# EAGLE schematic Master (EAGLE 7.1.0)
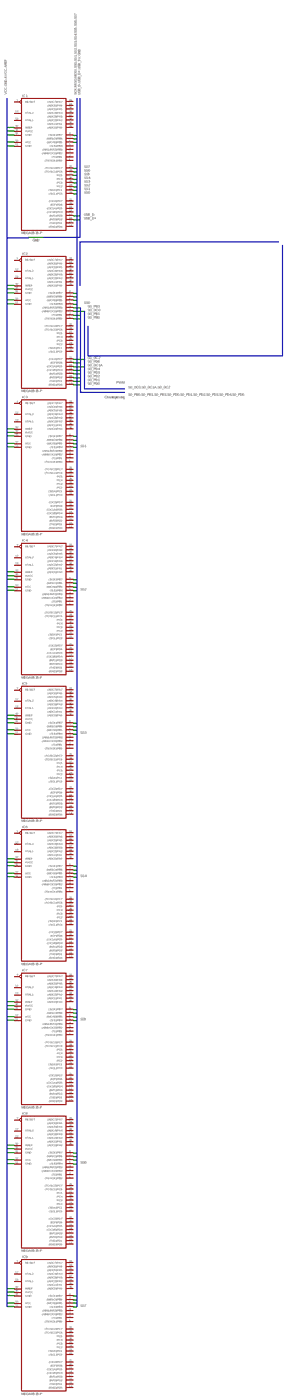
[diagram p0: schematic, sheet 1, overview]
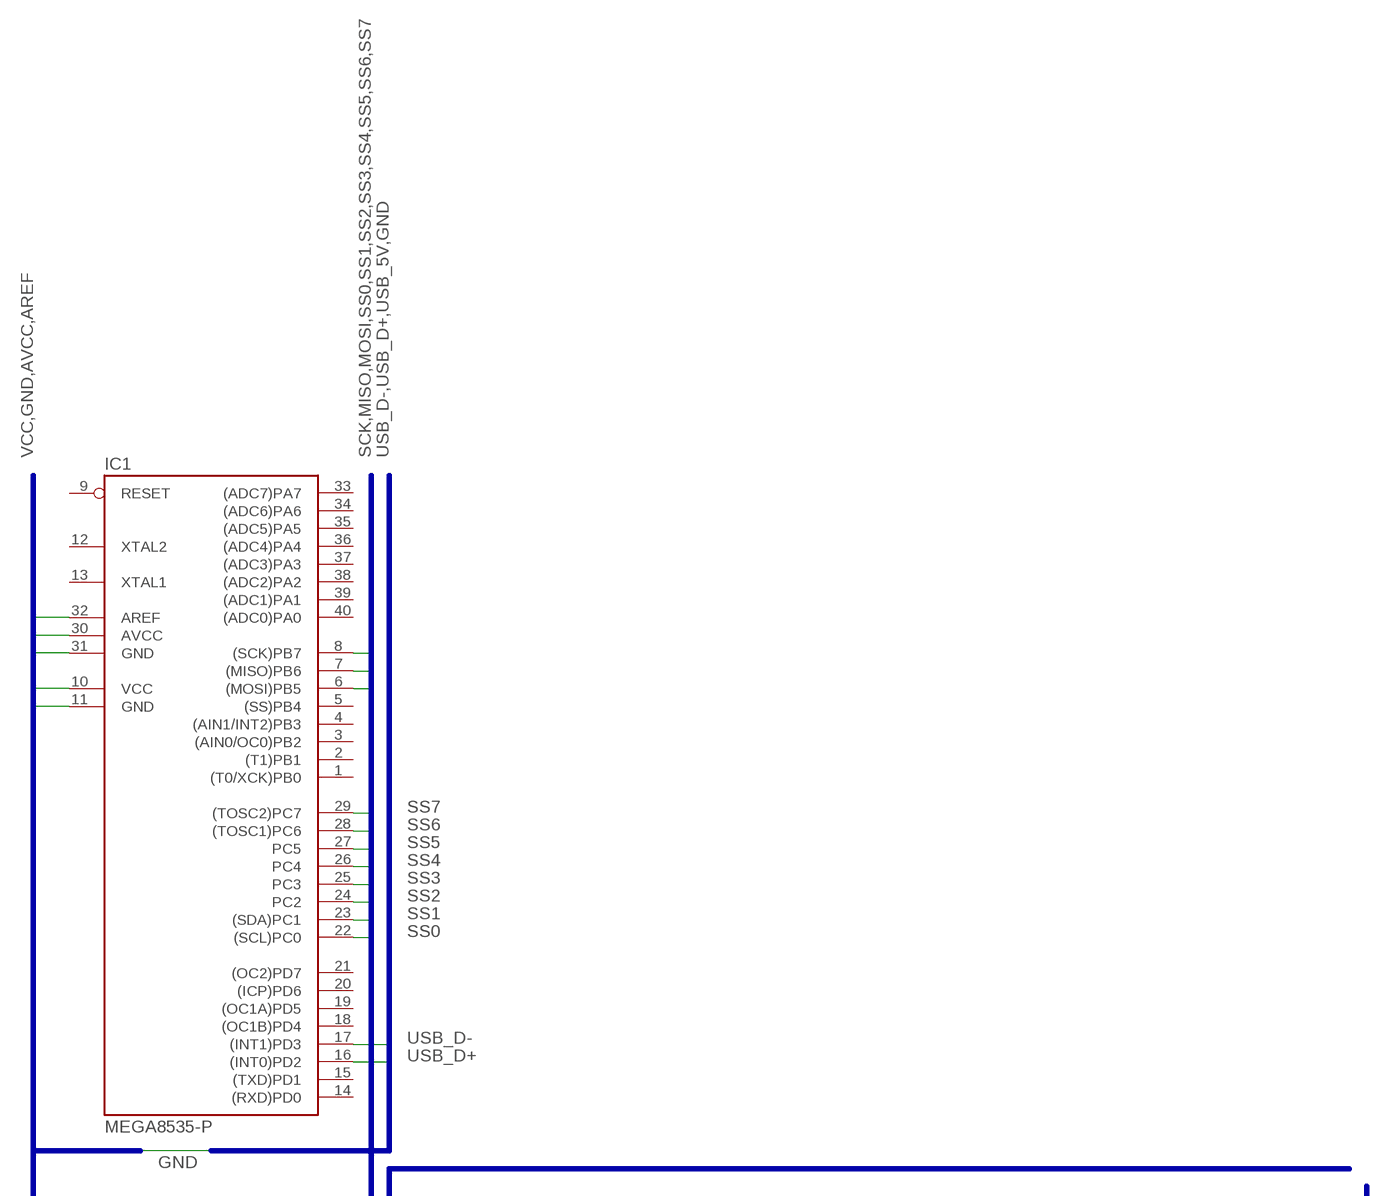
[diagram p1: schematic, sheet 1, part 1 of 4]
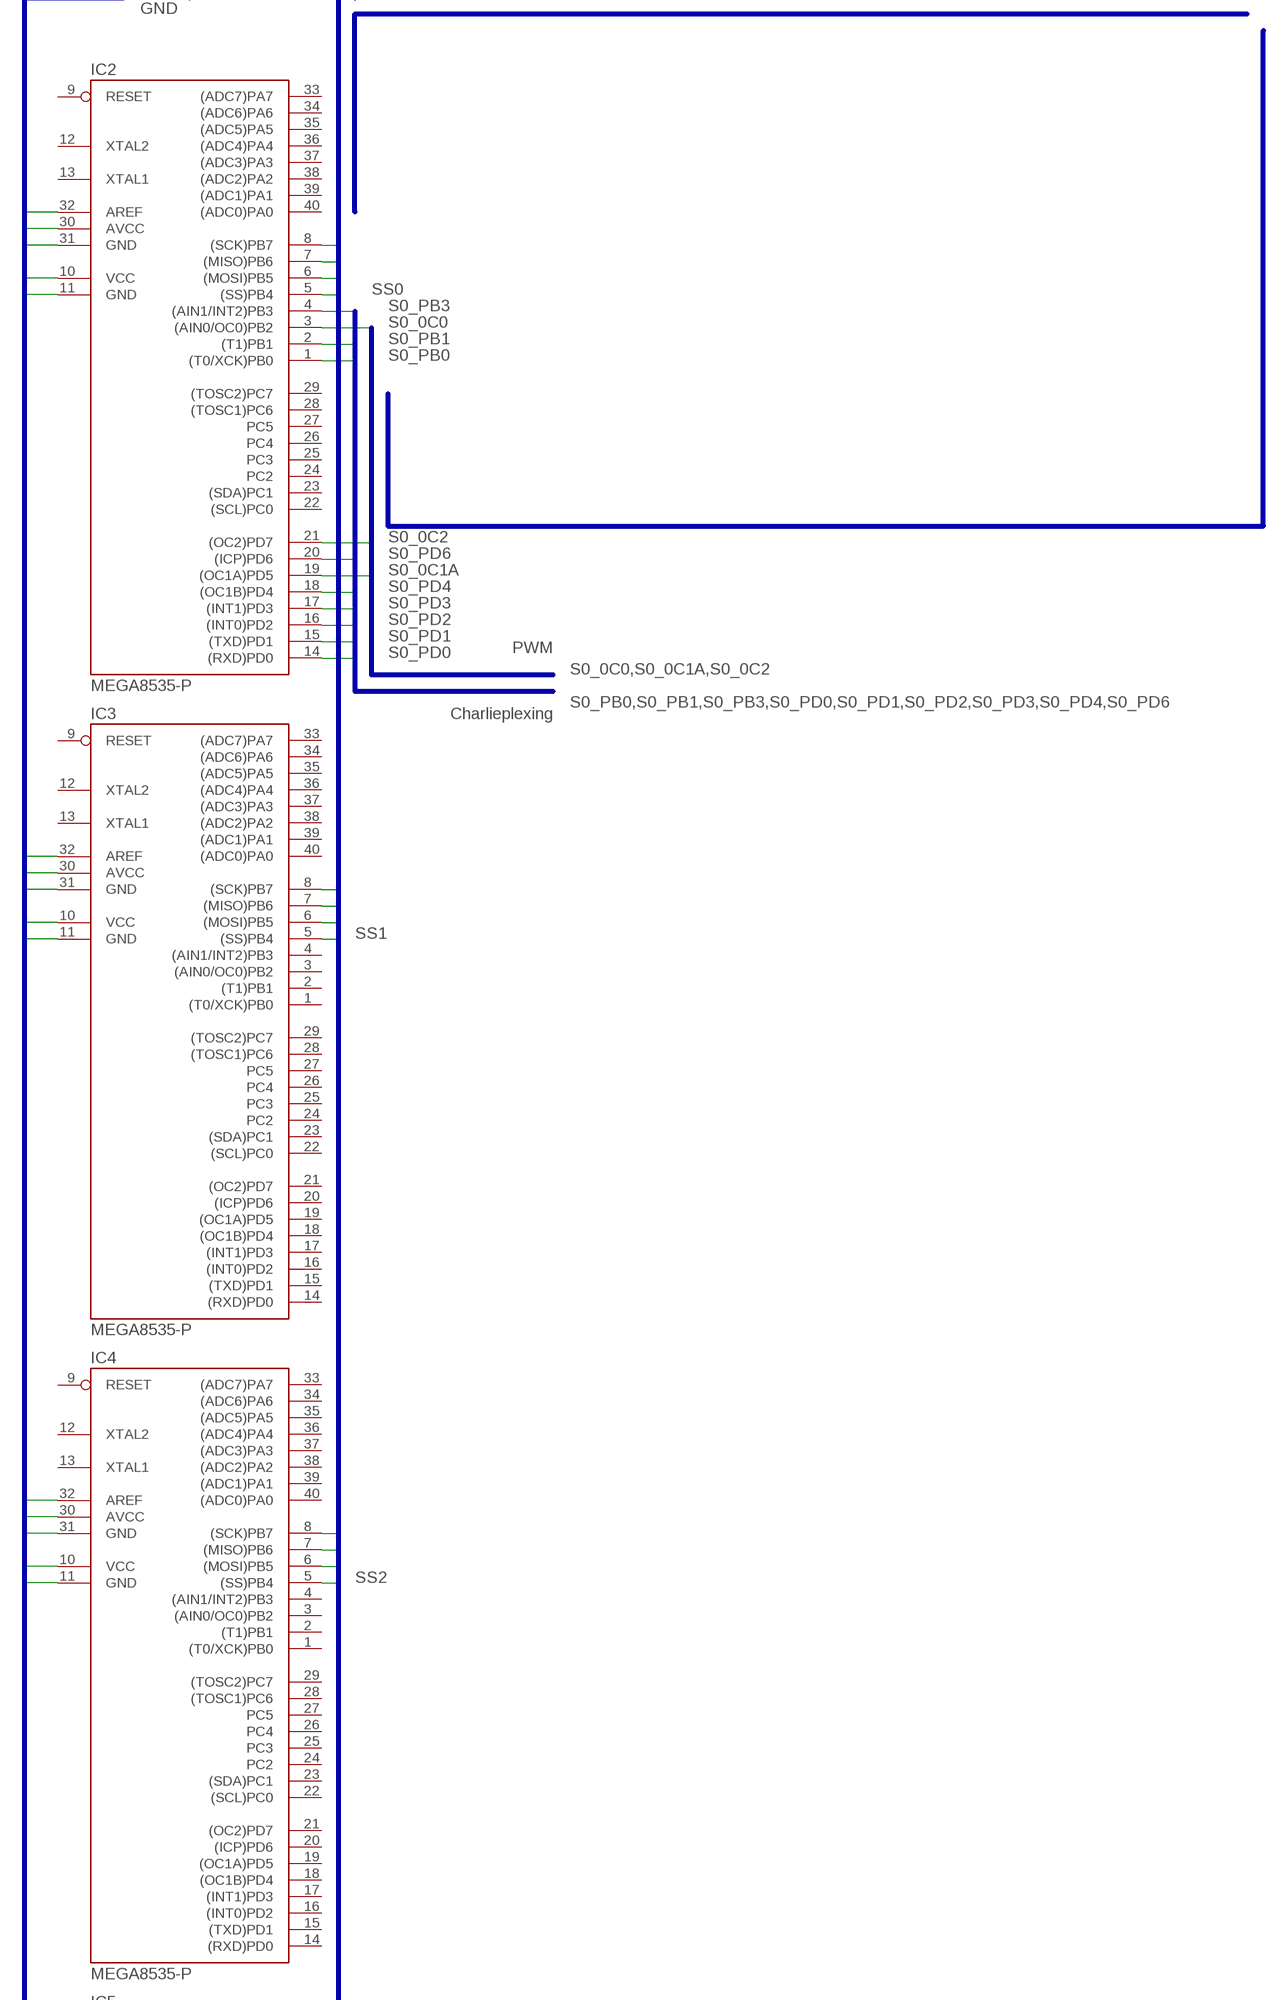
[diagram p2: schematic, sheet 1, part 2 of 4]
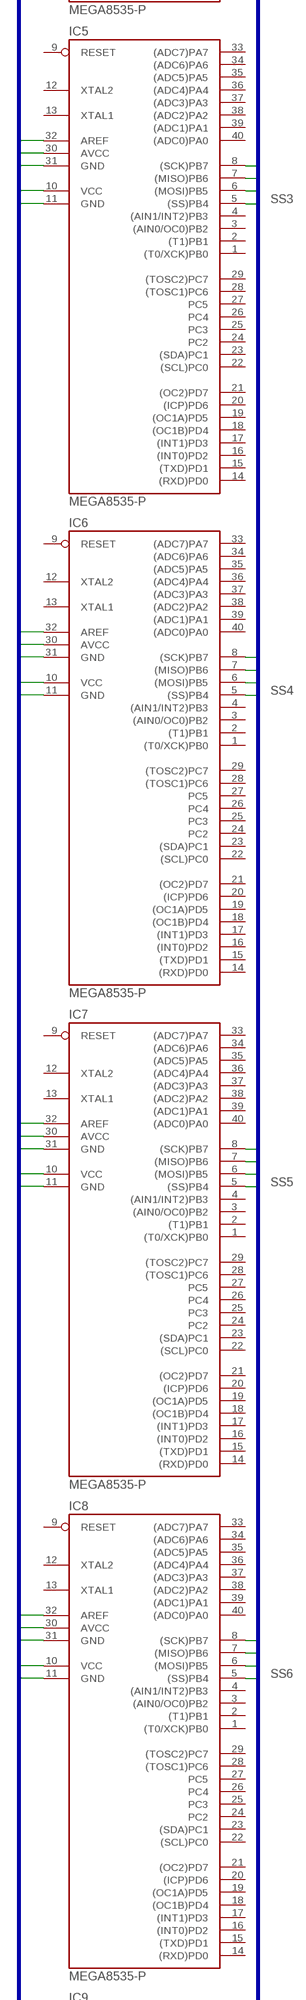
[diagram p3: schematic, sheet 1, part 3 of 4]
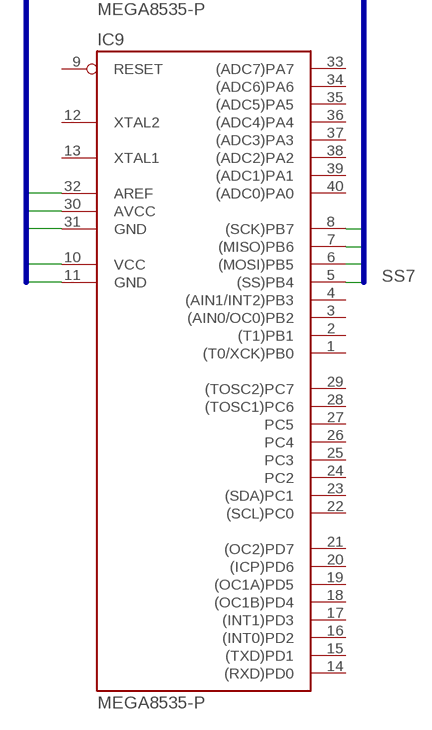
[diagram p4: schematic, sheet 1, part 4 of 4]

## Parts
IC1  MEGA8535-P  [DIL40]
IC2  MEGA8535-P  [DIL40]
IC3  MEGA8535-P  [DIL40]
IC4  MEGA8535-P  [DIL40]
IC5  MEGA8535-P  [DIL40]
IC6  MEGA8535-P  [DIL40]
IC7  MEGA8535-P  [DIL40]
IC8  MEGA8535-P  [DIL40]
IC9  MEGA8535-P  [DIL40]

## Nets
AREF: IC1.32(AREF) IC2.32(AREF) IC3.32(AREF) IC4.32(AREF) IC5.32(AREF) IC6.32(AREF) IC7.32(AREF) IC8.32(AREF) IC9.32(AREF)
AVCC: IC1.30(AVCC) IC2.30(AVCC) IC3.30(AVCC) IC4.30(AVCC) IC5.30(AVCC) IC6.30(AVCC) IC7.30(AVCC) IC8.30(AVCC) IC9.30(AVCC)
GND: IC1.11(GND) IC1.31(GND) IC2.11(GND) IC2.31(GND) IC3.11(GND) IC3.31(GND) IC4.11(GND) IC4.31(GND) IC5.11(GND) IC5.31(GND) IC6.11(GND) IC6.31(GND) IC7.11(GND) IC7.31(GND) IC8.11(GND) IC8.31(GND) IC9.11(GND) IC9.31(GND)
MISO: IC1.7((MISO)PB6) IC2.7((MISO)PB6) IC3.7((MISO)PB6) IC4.7((MISO)PB6) IC5.7((MISO)PB6) IC6.7((MISO)PB6) IC7.7((MISO)PB6) IC8.7((MISO)PB6) IC9.7((MISO)PB6)
MOSI: IC1.6((MOSI)PB5) IC2.6((MOSI)PB5) IC3.6((MOSI)PB5) IC4.6((MOSI)PB5) IC5.6((MOSI)PB5) IC6.6((MOSI)PB5) IC7.6((MOSI)PB5) IC8.6((MOSI)PB5) IC9.6((MOSI)PB5)
S0_0C0: IC2.3((AIN0/OC0)PB2)
S0_0C1A: IC2.19((OC1A)PD5)
S0_0C2: IC2.21((OC2)PD7)
S0_PB0: IC2.1((T0/XCK)PB0)
S0_PB1: IC2.2((T1)PB1)
S0_PB3: IC2.4((AIN1/INT2)PB3)
S0_PD0: IC2.14((RXD)PD0)
S0_PD1: IC2.15((TXD)PD1)
S0_PD2: IC2.16((INT0)PD2)
S0_PD3: IC2.17((INT1)PD3)
S0_PD4: IC2.18((OC1B)PD4)
S0_PD6: IC2.20((ICP)PD6)
SCK: IC1.8((SCK)PB7) IC2.8((SCK)PB7) IC3.8((SCK)PB7) IC4.8((SCK)PB7) IC5.8((SCK)PB7) IC6.8((SCK)PB7) IC7.8((SCK)PB7) IC8.8((SCK)PB7) IC9.8((SCK)PB7)
SS0: IC1.22((SCL)PC0) IC2.5((SS)PB4)
SS1: IC1.23((SDA)PC1) IC3.5((SS)PB4)
SS2: IC1.24(PC2) IC4.5((SS)PB4)
SS3: IC1.25(PC3) IC5.5((SS)PB4)
SS4: IC1.26(PC4) IC6.5((SS)PB4)
SS5: IC1.27(PC5) IC7.5((SS)PB4)
SS6: IC1.28((TOSC1)PC6) IC8.5((SS)PB4)
SS7: IC1.29((TOSC2)PC7) IC9.5((SS)PB4)
USB_D+: IC1.16((INT0)PD2)
USB_D-: IC1.17((INT1)PD3)
VCC: IC1.10(VCC) IC2.10(VCC) IC3.10(VCC) IC4.10(VCC) IC5.10(VCC) IC6.10(VCC) IC7.10(VCC) IC8.10(VCC) IC9.10(VCC)
Unconnected: IC1.1((T0/XCK)PB0) IC1.2((T1)PB1) IC1.3((AIN0/OC0)PB2) IC1.4((AIN1/INT2)PB3) IC1.5((SS)PB4) IC1.9(RESET) IC1.12(XTAL2) IC1.13(XTAL1) IC1.14((RXD)PD0) IC1.15((TXD)PD1) IC1.18((OC1B)PD4) IC1.19((OC1A)PD5) IC1.20((ICP)PD6) IC1.21((OC2)PD7) IC1.33((ADC7)PA7) IC1.34((ADC6)PA6) IC1.35((ADC5)PA5) IC1.36((ADC4)PA4) IC1.37((ADC3)PA3) IC1.38((ADC2)PA2) IC1.39((ADC1)PA1) IC1.40((ADC0)PA0) IC2.9(RESET) IC2.12(XTAL2) IC2.13(XTAL1) IC2.22((SCL)PC0) IC2.23((SDA)PC1) IC2.24(PC2) IC2.25(PC3) IC2.26(PC4) IC2.27(PC5) IC2.28((TOSC1)PC6) IC2.29((TOSC2)PC7) IC2.33((ADC7)PA7) IC2.34((ADC6)PA6) IC2.35((ADC5)PA5) IC2.36((ADC4)PA4) IC2.37((ADC3)PA3) IC2.38((ADC2)PA2) IC2.39((ADC1)PA1) IC2.40((ADC0)PA0) IC3.1((T0/XCK)PB0) IC3.2((T1)PB1) IC3.3((AIN0/OC0)PB2) IC3.4((AIN1/INT2)PB3) IC3.9(RESET) IC3.12(XTAL2) IC3.13(XTAL1) IC3.14((RXD)PD0) IC3.15((TXD)PD1) IC3.16((INT0)PD2) IC3.17((INT1)PD3) IC3.18((OC1B)PD4) IC3.19((OC1A)PD5) IC3.20((ICP)PD6) IC3.21((OC2)PD7) IC3.22((SCL)PC0) IC3.23((SDA)PC1) IC3.24(PC2) IC3.25(PC3) IC3.26(PC4) IC3.27(PC5) IC3.28((TOSC1)PC6) IC3.29((TOSC2)PC7) IC3.33((ADC7)PA7) IC3.34((ADC6)PA6) IC3.35((ADC5)PA5) IC3.36((ADC4)PA4) IC3.37((ADC3)PA3) IC3.38((ADC2)PA2) IC3.39((ADC1)PA1) IC3.40((ADC0)PA0) IC4.1((T0/XCK)PB0) IC4.2((T1)PB1) IC4.3((AIN0/OC0)PB2) IC4.4((AIN1/INT2)PB3) IC4.9(RESET) IC4.12(XTAL2) IC4.13(XTAL1) IC4.14((RXD)PD0) IC4.15((TXD)PD1) IC4.16((INT0)PD2) IC4.17((INT1)PD3) IC4.18((OC1B)PD4) IC4.19((OC1A)PD5) IC4.20((ICP)PD6) IC4.21((OC2)PD7) IC4.22((SCL)PC0) IC4.23((SDA)PC1) IC4.24(PC2) IC4.25(PC3) IC4.26(PC4) IC4.27(PC5) IC4.28((TOSC1)PC6) IC4.29((TOSC2)PC7) IC4.33((ADC7)PA7) IC4.34((ADC6)PA6) IC4.35((ADC5)PA5) IC4.36((ADC4)PA4) IC4.37((ADC3)PA3) IC4.38((ADC2)PA2) IC4.39((ADC1)PA1) IC4.40((ADC0)PA0) IC5.1((T0/XCK)PB0) IC5.2((T1)PB1) IC5.3((AIN0/OC0)PB2) IC5.4((AIN1/INT2)PB3) IC5.9(RESET) IC5.12(XTAL2) IC5.13(XTAL1) IC5.14((RXD)PD0) IC5.15((TXD)PD1) IC5.16((INT0)PD2) IC5.17((INT1)PD3) IC5.18((OC1B)PD4) IC5.19((OC1A)PD5) IC5.20((ICP)PD6) IC5.21((OC2)PD7) IC5.22((SCL)PC0) IC5.23((SDA)PC1) IC5.24(PC2) IC5.25(PC3) IC5.26(PC4) IC5.27(PC5) IC5.28((TOSC1)PC6) IC5.29((TOSC2)PC7) IC5.33((ADC7)PA7) IC5.34((ADC6)PA6) IC5.35((ADC5)PA5) IC5.36((ADC4)PA4) IC5.37((ADC3)PA3) IC5.38((ADC2)PA2) IC5.39((ADC1)PA1) IC5.40((ADC0)PA0) IC6.1((T0/XCK)PB0) IC6.2((T1)PB1) IC6.3((AIN0/OC0)PB2) IC6.4((AIN1/INT2)PB3) IC6.9(RESET) IC6.12(XTAL2) IC6.13(XTAL1) IC6.14((RXD)PD0) IC6.15((TXD)PD1) IC6.16((INT0)PD2) IC6.17((INT1)PD3) IC6.18((OC1B)PD4) IC6.19((OC1A)PD5) IC6.20((ICP)PD6) IC6.21((OC2)PD7) IC6.22((SCL)PC0) IC6.23((SDA)PC1) IC6.24(PC2) IC6.25(PC3) IC6.26(PC4) IC6.27(PC5) IC6.28((TOSC1)PC6) IC6.29((TOSC2)PC7) IC6.33((ADC7)PA7) IC6.34((ADC6)PA6) IC6.35((ADC5)PA5) IC6.36((ADC4)PA4) IC6.37((ADC3)PA3) IC6.38((ADC2)PA2) IC6.39((ADC1)PA1) IC6.40((ADC0)PA0) IC7.1((T0/XCK)PB0) IC7.2((T1)PB1) IC7.3((AIN0/OC0)PB2) IC7.4((AIN1/INT2)PB3) IC7.9(RESET) IC7.12(XTAL2) IC7.13(XTAL1) IC7.14((RXD)PD0) IC7.15((TXD)PD1) IC7.16((INT0)PD2) IC7.17((INT1)PD3) IC7.18((OC1B)PD4) IC7.19((OC1A)PD5) IC7.20((ICP)PD6) IC7.21((OC2)PD7) IC7.22((SCL)PC0) IC7.23((SDA)PC1) IC7.24(PC2) IC7.25(PC3) IC7.26(PC4) IC7.27(PC5) IC7.28((TOSC1)PC6) IC7.29((TOSC2)PC7) IC7.33((ADC7)PA7) IC7.34((ADC6)PA6) IC7.35((ADC5)PA5) IC7.36((ADC4)PA4) IC7.37((ADC3)PA3) IC7.38((ADC2)PA2) IC7.39((ADC1)PA1) IC7.40((ADC0)PA0) IC8.1((T0/XCK)PB0) IC8.2((T1)PB1) IC8.3((AIN0/OC0)PB2) IC8.4((AIN1/INT2)PB3) IC8.9(RESET) IC8.12(XTAL2) IC8.13(XTAL1) IC8.14((RXD)PD0) IC8.15((TXD)PD1) IC8.16((INT0)PD2) IC8.17((INT1)PD3) IC8.18((OC1B)PD4) IC8.19((OC1A)PD5) IC8.20((ICP)PD6) IC8.21((OC2)PD7) IC8.22((SCL)PC0) IC8.23((SDA)PC1) IC8.24(PC2) IC8.25(PC3) IC8.26(PC4) IC8.27(PC5) IC8.28((TOSC1)PC6) IC8.29((TOSC2)PC7) IC8.33((ADC7)PA7) IC8.34((ADC6)PA6) IC8.35((ADC5)PA5) IC8.36((ADC4)PA4) IC8.37((ADC3)PA3) IC8.38((ADC2)PA2) IC8.39((ADC1)PA1) IC8.40((ADC0)PA0) IC9.1((T0/XCK)PB0) IC9.2((T1)PB1) IC9.3((AIN0/OC0)PB2) IC9.4((AIN1/INT2)PB3) IC9.9(RESET) IC9.12(XTAL2) IC9.13(XTAL1) IC9.14((RXD)PD0) IC9.15((TXD)PD1) IC9.16((INT0)PD2) IC9.17((INT1)PD3) IC9.18((OC1B)PD4) IC9.19((OC1A)PD5) IC9.20((ICP)PD6) IC9.21((OC2)PD7) IC9.22((SCL)PC0) IC9.23((SDA)PC1) IC9.24(PC2) IC9.25(PC3) IC9.26(PC4) IC9.27(PC5) IC9.28((TOSC1)PC6) IC9.29((TOSC2)PC7) IC9.33((ADC7)PA7) IC9.34((ADC6)PA6) IC9.35((ADC5)PA5) IC9.36((ADC4)PA4) IC9.37((ADC3)PA3) IC9.38((ADC2)PA2) IC9.39((ADC1)PA1) IC9.40((ADC0)PA0)

## Buses
SCK,MISO,MOSI,SS0,SS1,SS2,SS3,SS4,SS5,SS6,SS7
USB_D-,USB_D+,USB_5V,GND
VCC,GND,AVCC,AREF
B$1
B$2
S0_PB0,S0_PB1,S0_PB3,S0_PD0,S0_PD1,S0_PD2,S0_PD3,S0_PD4,S0_PD6
S0_0C0,S0_0C1A,S0_0C2

## Notes on the sheet
- PWM
- Charlieplexing

## Library data of the parts
IC1-IC9 = librarie:MEGA8535-P: MICROCONTROLLER 8 Kbytes FLASH 512 bytes SRAM 512 bytes EEPROM USART 8-channel 10 bit ADC Source: avr.lbr; MPN: ATMEGA8535-16PU; OC_FARNELL: 9171444; OC_NEWARK: 01M6909